# Altium schematic sheet 底板.SchDoc
size A4
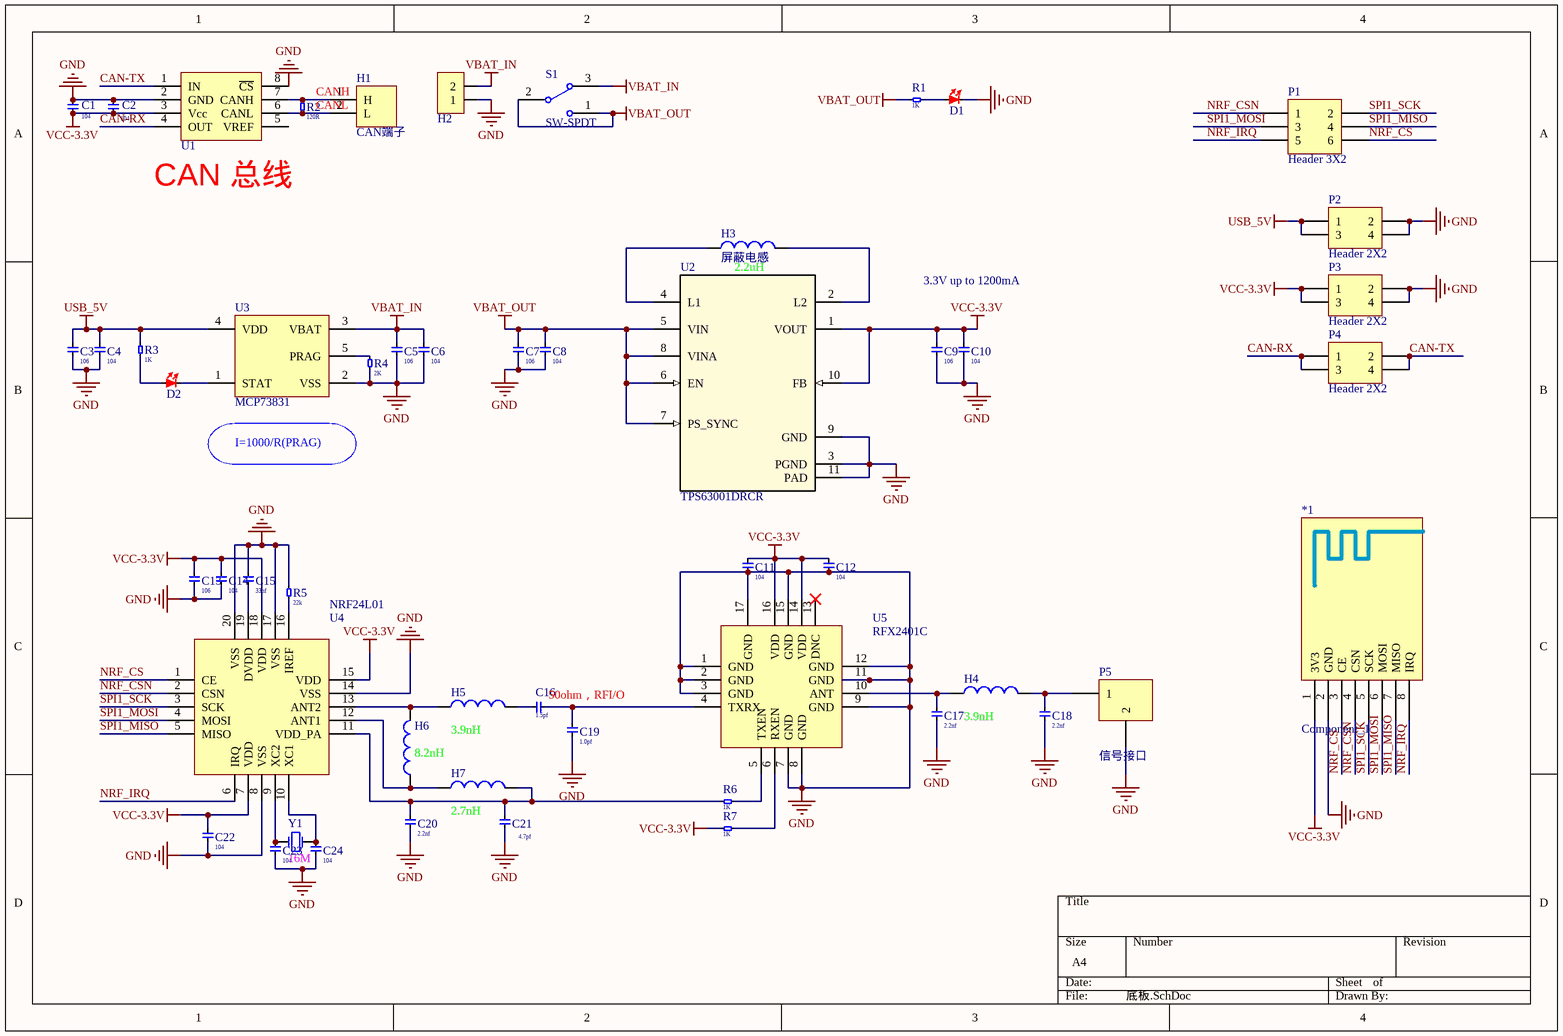
[diagram p0: 底板.SchDoc]

## Parts
*1  Component_1  [PCBComponent_1]
C1  CAP0603  [CAP0603]  (value not drawn)
C2  CAP0603  [CAP0603]  (value not drawn)
C3  CAP0603  [CAP0603]  (value not drawn)
C4  CAP0603  [CAP0603]  (value not drawn)
C5  CAP0603  [CAP0603]  (value not drawn)
C6  CAP0603  [CAP0603]  (value not drawn)
C7  CAP0603  [CAP0603]  (value not drawn)
C8  CAP0603  [CAP0603]  (value not drawn)
C9  CAP0603  [CAP0603]  (value not drawn)
C10  CAP0603  [CAP0603]  (value not drawn)
C11  CAP0603  [CAP0603]  (value not drawn)
C12  CAP0603  [CAP0603]  (value not drawn)
C13  CAP0603  [CAP0603]  (value not drawn)
C14  CAP0603  [CAP0603]  (value not drawn)
C15  CAP0603  [CAP0603]  (value not drawn)
C16  CAP0603  [CAP0603]  (value not drawn)
C17  CAP0603  [CAP0603]  (value not drawn)
C18  CAP0603  [CAP0603]  (value not drawn)
C19  CAP0603  [CAP0603]  (value not drawn)
C20  CAP0603  [CAP0603]  (value not drawn)
C21  CAP0603  [CAP0603]  (value not drawn)
C22  CAP0603  [CAP0603]  (value not drawn)
C23  CAP0603  [CAP0603]  (value not drawn)
C24  CAP0603  [CAP0603]  (value not drawn)
D1  LED  [LED_0603_B]  (value not drawn)
D2  LED  [LED_0603_B]  (value not drawn)
H1  CAN端子  [CAN端子]
H2  H2  [H2_WHITE]  (value not drawn)
H3  屏蔽电感  [屏蔽7.2*7.2]
H4  屏蔽电感  [CAP0603]  (value not drawn)
H5  屏蔽电感  [CAP0603]  (value not drawn)
H6  屏蔽电感  [CAP0603]  (value not drawn)
H7  屏蔽电感  [CAP0603]  (value not drawn)
P1  Header 3X2  [HDR2X3]
P2  Header 2X2  [HDR2X2]
P3  Header 2X2  [HDR2X2]
P4  Header 2X2  [HDR2X2]
P5  信号接口  [SMA-偏脚]
R1  电阻R  [R0603]  (value not drawn)
R2  电阻R  [R0603]  (value not drawn)
R3  电阻R  [R0603]  (value not drawn)
R4  电阻R  [R0603]  (value not drawn)
R5  电阻R  [R0603]  (value not drawn)
R6  电阻R  [R0603]  (value not drawn)
R7  电阻R  [R0603]  (value not drawn)
S1  SW-SPDT  [SWITCH_A2]
U1  VP230  [VP230]  (value not drawn)
U2  TPS63001DRCR  [TPS63001]
U3  MCP73831  [SOT-23-5]
U4  NRF24L01  [QFN50P400X400X85_HS-21N]
U5  RFX2401C  [QFN50P300X300X55_HS-17N]
Y1  XTAL  [XTAL]  (value not drawn)

## Nets
GND: *1.2(GND) C1.2 C2.2 C3.1 C4.1 C5.1 C6.1 C7.1 C8.1 C9.1 C10.1 C11.1 C12.1 C13.1 C14.1 C15.2 C17.1 C18.1 C19.2 C20.2 C21.2 C22.1 C23.1 C24.1 D1.2 H2.1 P2.2 P2.4 P3.2 P3.4 P5.2 R4.1 R5.2 U1.2(GND) U1.8(~{CS}) U2.3(PGND) U2.9(GND) U2.11(PAD) U3.2(VSS) U4.8(VSS) U4.14(VSS) U4.17(VSS) U4.20(VSS) U5.1(GND) U5.2(GND) U5.3(GND) U5.7(GND) U5.8(GND) U5.9(GND) U5.11(GND) U5.12(GND) U5.15(GND) U5.17(GND)
USB_5V: C3.2 C4.2 P2.1 P2.3 R3.2 U3.4(VDD)
VBAT_IN: C5.2 C6.2 H2.2 S1.3 U3.3(VBAT)
VBAT_OUT: C7.2 C8.2 R1.2 S1.1 S1.2 U2.5(VIN) U2.6(EN) U2.7(PS_SYNC) U2.8(VINA)
VCC-3.3V: *1.1(3V3) C1.1 C2.1 C9.2 C10.2 C11.2 C12.2 C13.2 C14.2 C22.2 P3.1 P3.3 R7.2 U1.3(Vcc) U2.1(VOUT) U2.10(FB) U4.7(VDD) U4.15(VDD) U4.18(VDD) U5.14(VDD) U5.16(VDD)
CAN-RX: P4.1 P4.3 U1.4(OUT)
CAN-TX: P4.2 P4.4 U1.1(IN)
CANH: H1.1(H) R2.2 U1.7(CANH)
CANL: H1.2(L) R2.1 U1.6(CANL)
NRF_CS: *1.3(CE) P1.6 U4.1(CE)
NRF_CSN: *1.4(CSN) P1.1 U4.2(CSN)
NRF_IRQ: *1.8(IRQ) P1.5 U4.6(IRQ)
SPI1_MISO: *1.7(MISO) P1.4 U4.5(MISO)
SPI1_MOSI: *1.6(MOSI) P1.3 U4.4(MOSI)
SPI1_SCK: *1.5(SCK) P1.2 U4.3(SCK)
NetC15_1: C15.1 U4.19(DVDD)
NetC16_1: C16.1 C19.1 U5.4(TXRX)
NetC16_2: C16.2 H5.2
NetC17_2: C17.2 H4.1 U5.10(ANT)
NetC18_2: C18.2 H4.2 P5.1
NetC20_1: C20.1 C21.1 H7.2 R6.2 U4.11(VDD_PA)
NetC23_2: C23.2 U4.9(XC2) Y1.1(OSC1)
NetC24_2: C24.2 U4.10(XC1) Y1.2(OSC2)
NetD1_1: D1.1 R1.1
NetD2_1: D2.1 R3.1
NetD2_2: D2.2 U3.1(STAT)
NetH3_1: H3.1 U2.4(L1)
NetH3_2: H3.2 U2.2(L2)
NetH5_1: H5.1 H6.2 U4.13(ANT2)
NetH6_1: H6.1 H7.1 U4.12(ANT1)
NetR4_2: R4.2 U3.5(PRAG)
NetR5_1: R5.1 U4.16(IREF)
NetR6_1: R6.1 U5.5(TXEN)
NetR7_1: R7.1 U5.6(RXEN)

Not connected (* = marked no-connect by the designer): U1 5(VREF); U5 13(DNC)*

## Notes on the sheet
- (near U1) CAN 总线
- 3.3V up to 1200mA
- I=1000/R(PRAG)
- (near C16) 50ohm，RFI/O
- (in symbol CAP0603) 106; 104; 33nf; 1.5pf; 1.0pf; 2.2nf; 4.7pf
- (in symbol XTAL) 16M
- (in symbol 屏蔽电感) 2.2uH; 3.9nH; 8.2nH; 2.7nH
- (in symbol 电阻R) 1K; 2K; 22k; 120R

## Library data of the parts
H2 = H2: 排针
P1 = Header 3X2: Header, 3-Pin, Dual row; LatestRevisionDate: 17-Jul-2002; LatestRevisionNote: Re-released for DXP Platform.; Publisher: Altium Limited
P2-P4 = Header 2X2: Header, 2-Pin, Dual row; LatestRevisionDate: 17-Jul-2002; LatestRevisionNote: Re-released for DXP Platform.; Publisher: Altium Limited
P5 = SMA偏脚: LatestRevisionDate: 17-Jul-2002; LatestRevisionNote: Re-released for DXP Platform.; Publisher: Altium Limited
S1 = SW-SPDT: 开关; Published: 24-Mar-1999; LatestRevisionDate: 17-Dec-2003; LatestRevisionNote: Schematic revised, PCB Footprint replaced.; DatasheetDocument: 05-Dec-2000; PackageReference: TL36WW15050; Publisher: Altium Limited; ComponentLink1Description: Manufacturer Link; ComponentLink1URL: http://www.apem.com
U1 = VP230: CAN 芯片
U2 = TPS63001DRCR: Imported; Alternate_PartNumber: TPS63001DRCT; Manufacturer: Texas Instruments; CompType: IC; PIN_COUNT: 11; Application_BuildNumber: *; PartNumber: TPS63001DRCR; PackageReference: DRC0010J; MountType: SMT; RoHS: Y; RefDes: RefDes; TYPE: TYPE; Value: Value
U4 = NRF24L01_1
Y1 = XTAL: 晶振